# Altium project Sampling_Scope.PrjPcb (part 4 of 4)

## Sheet USB_C_PD.SchDoc
size A4; ApprovedBy: Mateusz Kowalik; CheckedBy: Mateusz Kowalik; Author: Mateusz Kowalik; CompanyName: InMotion Labs sp. z o.o.; DrawnBy: Mateusz Kowalik; Engineer: Mateusz Kowalik; Organization: InMotion Labs sp. z o.o.; Address1: Rydlówka 5A; Address2: 30-363 Kraków; Address4: Poland; DocumentNumber: 17; Revision: Rev 0; SheetNumber: 17; SheetTotal: 17
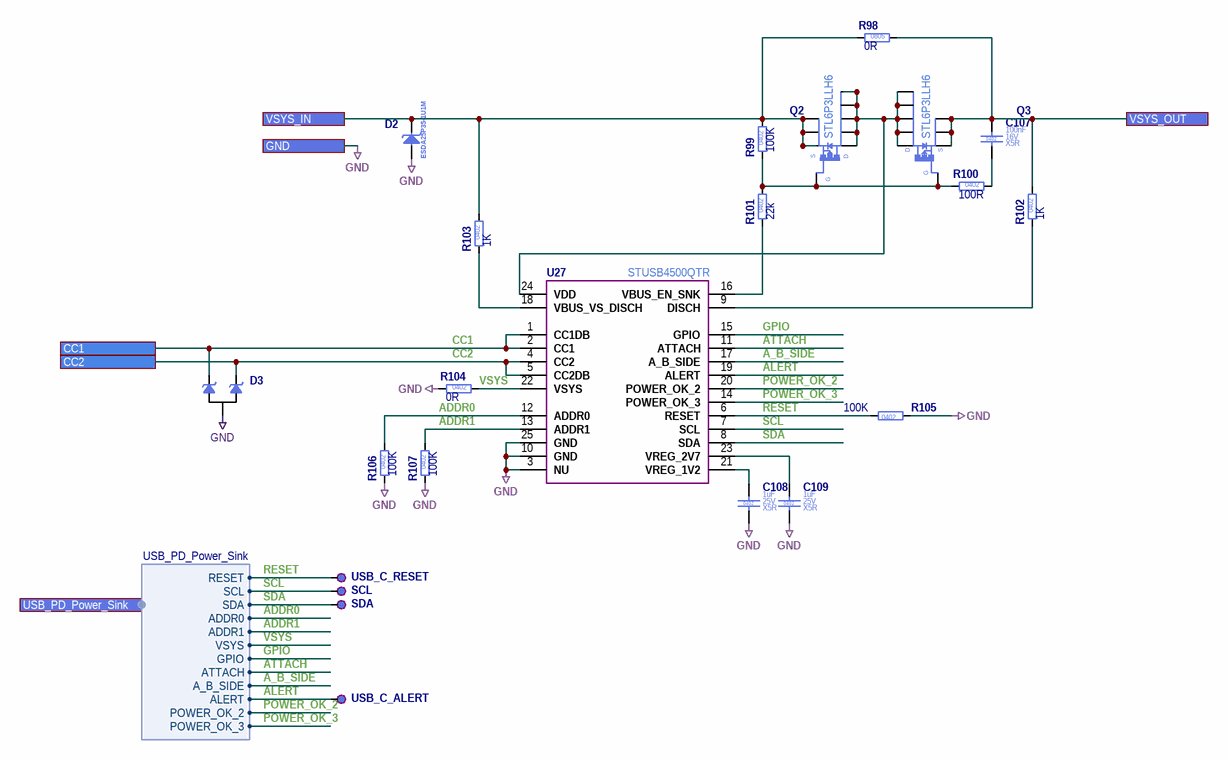
[diagram p17: USB_C_PD.SchDoc]

### Parts
C107  Case/Package: 0402  Voltage Rating (DC): 16V  Dielectric: X5R  Capacitance: 100nF  [C_0402_1005]  (hidden comment: C_100NF_16V_X5R_0402_10)
C108  Case/Package: 0402  Voltage Rating (DC): 25V  Dielectric: X5R  Capacitance: 1uF  [C_0402_1005]  (hidden comment: C_1UF_25V_X5R_0402_10)
C109  Case/Package: 0402  Voltage Rating (DC): 25V  Dielectric: X5R  Capacitance: 1uF  [C_0402_1005]  (hidden comment: C_1UF_25V_X5R_0402_10)
D2  ESDA25P35-1U1M  [TVS_0603_1610]
D3  ESDA25W  [SOT323_SC70]  (value not drawn)
Q2  STL6P3LLH6  [PQFN65P330X332X105_HS-9N]
Q3  STL6P3LLH6  [PQFN65P330X332X105_HS-9N]
R98  Resistance: 0R  Case/Package: 0805  [R_0805_2012]  (hidden comment: R_0R_0805_1)
R99  Resistance: 100K  Case/Package: 0402  [R_0402_1005]  (hidden comment: R_100K_0402_1)
R100  Resistance: 100R  Case/Package: 0402  [R_0402_1005]  (hidden comment: R_100R_0402_1)
R101  Resistance: 22k  Case/Package: 0402  [R_0402_1005]  (hidden comment: R_22K_0402_1)
R102  Resistance: 1K  Case/Package: 0402  [R_0402_1005]  (hidden comment: R_1K_0402_1)
R103  Resistance: 1K  Case/Package: 0402  [R_0402_1005]  (hidden comment: R_1K_0402_1)
R104  Resistance: 0R  Case/Package: 0402  [R_0402_1005]  (hidden comment: R_0R_0402_1)
R105  Resistance: 100K  Case/Package: 0402  [R_0402_1005]  (hidden comment: R_100K_0402_1)
R106  Resistance: 100K  Case/Package: 0402  [R_0402_1005]  (hidden comment: R_100K_0402_1)
R107  Resistance: 100K  Case/Package: 0402  [R_0402_1005]  (hidden comment: R_100K_0402_1)
SCL  TP_PAD_1.3MM  [TP_PAD_1.3MM]  (value not drawn)  (no BOM)
SDA  TP_PAD_1.3MM  [TP_PAD_1.3MM]  (value not drawn)  (no BOM)
U27  STUSB4500QTR  [QFN50P400X400X100_HS-25N]
USB_C_ALERT  TP_PAD_1.3MM  [TP_PAD_1.3MM]  (value not drawn)  (no BOM)
USB_C_RESET  TP_PAD_1.3MM  [TP_PAD_1.3MM]  (value not drawn)  (no BOM)

### Ports
CC1, CC2, GND, USB_PD_Power_Sink (harness USB_PD_Power_Sink), VSYS_IN, VSYS_OUT

### Harnesses
USB_PD_Power_Sink: RESET, SCL, SDA, ADDR0, ADDR1, VSYS, GPIO, ATTACH, A_B_SIDE, ALERT, POWER_OK_2, POWER_OK_3

### Nets
5V0_USB: C107.1 Q3.1(S) Q3.2(S) Q3.3(S) R98.2 R102.2 ; port VSYS_OUT
5V0_VBUS: D2.1(C) Q2.1(S) Q2.2(S) Q2.3(S) R98.1 R99.2 R103.2 ; port VSYS_IN
GND: C108.2 C109.2 D2.2(A) D3.3 R104.1 R105.1 R106.1 R107.1 U27.3(NU) U27.10(GND) U27.25(GND) ; port GND
A_B_SIDE: U27.17(A_B_SIDE) ; port USB_PD_Power_Sink.A_B_SIDE  [project net USB_PD_Power_Sink.A_B_SIDE]
ADDR0: R106.2 U27.12(ADDR0) ; port USB_PD_Power_Sink.ADDR0  [project net USB_PD_Power_Sink.ADDR0]
ADDR1: R107.2 U27.13(ADDR1) ; port USB_PD_Power_Sink.ADDR1  [project net USB_PD_Power_Sink.ADDR1]
ALERT: U27.19(ALERT) USB_C_ALERT.1(TP) ; port USB_PD_Power_Sink.ALERT  [project net USB_PD_Power_Sink.ALERT]
ATTACH: U27.11(ATTACH) ; port USB_PD_Power_Sink.ATTACH  [project net USB_PD_Power_Sink.ATTACH]
CC1: D3.1 U27.1(CC1DB) U27.2(CC1) ; port CC1
CC2: D3.2 U27.4(CC2) U27.5(CC2DB) ; port CC2
GPIO: U27.15(GPIO) ; port USB_PD_Power_Sink.GPIO  [project net USB_PD_Power_Sink.GPIO]
POWER_OK_2: U27.20(POWER_OK_2) ; port USB_PD_Power_Sink.POWER_OK_2  [project net USB_PD_Power_Sink.POWER_OK_2]
POWER_OK_3: U27.14(POWER_OK_3) ; port USB_PD_Power_Sink.POWER_OK_3  [project net USB_PD_Power_Sink.POWER_OK_3]
RESET: R105.2 U27.6(RESET) USB_C_RESET.1(TP) ; port USB_PD_Power_Sink.RESET  [project net USB_PD_Power_Sink.RESET]
SCL: SCL.1(TP) U27.7(SCL) ; port USB_PD_Power_Sink.SCL  [project net USB_PD_Power_Sink.SCL]
SDA: SDA.1(TP) U27.8(SDA) ; port USB_PD_Power_Sink.SDA  [project net USB_PD_Power_Sink.SDA]
VSYS: R104.2 U27.22(VSYS) ; port USB_PD_Power_Sink.VSYS  [project net USB_PD_Power_Sink.VSYS]
NetC107_2: C107.2 R100.2
NetC108_1: C108.1 U27.21(VREG_1V2)
NetC109_1: C109.1 U27.23(VREG_2V7)
NetQ2_4: Q2.4(G) Q3.4(G) R99.1 R100.1 R101.2
NetQ2_5: Q2.5(D) Q2.6(D) Q2.7(D) Q2.8(D) Q2.9(D) Q3.5(D) Q3.6(D) Q3.7(D) Q3.8(D) Q3.9(D) U27.24(VDD)
NetR101_1: R101.1 U27.16(VBUS_EN_SNK)
NetR102_1: R102.1 U27.9(DISCH)
NetR103_1: R103.1 U27.18(VBUS_VS_DISCH)

### Notes on the sheet
- Title
- Size:
- Date:
- A4

### Library data of the parts
C107 = C_100NF_16V_X5R_0402_10: Ceramic Capacitor; Manufacturer Part Number: EMK105BJ104KV-F; Manufacturer: Taiyo Yuden; Value: 100nF; Tolerance: 10%; Part Number: C_100NF_16V_X5R_0402_10; Mount: Surface Mount; Height: 500um; HelpURL: http://datasheet.octopart.com/EMK105BJ104KV-F-Taiyo-Yuden-datasheet-8857305.pdf; RoHS: Compliant; Max Operating Temperature: 125°C; Status: MK; Supplier 1: Mouser; Supplier Part Number 1: 963-EMK105BJ104KV-F; Manufacturer 2: Samsung Electro-Mechanics; Manufacturer Part Number 2: CL05B104KO5NNNC; Supplier 2: LCSC; Supplier Part Number 2: C1525
C108 C109 = C_1UF_25V_X5R_0402_10: Ceramic Capacitor; Manufacturer Part Number: CL05A105KA5NQNC; Manufacturer: Samsung Electro-Mechanics; Value: 1uF; Tolerance: 10%; Part Number: C_1UF_25V_X5R_0402_10; Mount: Surface Mount; Height: 550um; HelpURL: https://pl.mouser.com/datasheet/2/585/MLCC-1837944.pdf; RoHS: Compliant; Max Operating Temperature: 85°C; Status: MK; Supplier 1: Mouser; Supplier Part Number 1: 187-CL05A105KA5NQNC; Manufacturer 2: Samsung Electro-Mechanics; Manufacturer Part Number 2: CL05A105KA5NQNC; Supplier 2: LCSC; Supplier Part Number 2: C52923
D2 = ESDA25P35-1U1M: High power transient voltage suppressor; Manufacturer: STMicroelectronics; Max Power Dissipation: 1400W; Direction: Unidirectional; Max Breakdown Voltage: 24.6; Working Voltage: 22V; Min Breakdown Voltage: 23.3V; Box: 391; Part Number: ESDA25P35-1U1M; Case/Package: 0603; Manufacturer Part Number: ESDA25P35-1U1M; Mount: Surface Mount; HelpURL: https://pl.mouser.com/datasheet/2/389/esda25p35_1u1m-1848969.pdf; Max Operating Temperature: 150°C; RoHS: Compliant; Status: MK; Supplier 1: Mouser; Supplier Part Number 1: 511-ESDA25P35-1U1M; Height: 600um; Stock: 20
D3 = ESDA25W: TVS DIODE 24VWM SOT23; Manufacturer: STMicroelectronics; Capacitance: 65pF; Max Power Dissipation: 400W; Direction: Unidirectional; Max Breakdown Voltage: 30V; Working Voltage: 24V; Min Breakdown Voltage: 25V; Box: 395; Part Number: ESDA25W; Case/Package: SOT-23; Manufacturer Part Number: ESDA25W; Mount: Surface Mount; HelpURL: https://pl.mouser.com/datasheet/2/389/esdaxxxwx-1849182.pdf; Max Operating Temperature: 125°C; Height: 1.4mm; Status: MK; Supplier 1: Mouser; Supplier Part Number 1: 511-ESDA25W; Stock: 5
Q2 Q3 = STL6P3LLH6: P-MOSFET 30V 6A 24mOhm; Manufacturer: STMicroelectronics; Max Power Dissipation: 2.9W; Drain to Source Resistance: 24mR; Polarization: PMOS; Threshold Voltage: 1V; Box: 399; Part Number: STL6P3LLH6; Manufacturer Part Number: STL6P3LLH6; Case/Package: PQFN; Continuous Drain Current: 6A; Drain to Source Voltage: 30V; Mount: Surface Mount; HelpURL: https://pl.mouser.com/datasheet/2/389/stl6p3llh6-1851075.pdf; Max Operating Temperature: 150°C; Status: MK; RoHS: Compliant; Supplier 1: Mouser; Supplier Part Number 1: 511-STL6P3LLH6; Stock: 15
R98 = R_0R_0805_1: Thick Film Resistor; Manufacturer: Yageo; Manufacturer Part Number: RC0805JR-070RL; Value: 0R; Tolerance: 5%; Voltage Rating (DC): 150V; Power Rating: 125mW; Stats: MK; Part Number: R_0R_0805_1; Mount: Surface Mount; Height: 500um; HelpURL: https://pl.mouser.com/datasheet/2/447/PYu-RC_Group_51_RoHS_L_10-1527934.pdf; RoHS: Compliant; Max Operating Temperature: 155°C; Supplier 1: Mouser; Supplier Part Number 1: 603-RC0805JR-070RL; Manufacturer 2: Uniroyal Elec; Manufacturer Part Number 2: 0805W8F0000T5E; Supplier 2: LCSC; Supplier Part Number 2: C17477
R99 R105-R107 = R_100K_0402_1: Thick Film Resistor; Manufacturer: Yageo; Manufacturer Part Number: RC0402FR-07100KL; Value: 100K; Tolerance: 1%; Voltage Rating (DC): 50V; Power Rating: 63mW; Stats: MK; Part Number: R_100K_0402_1; Mount: Surface Mount; Height: 350um; HelpURL: http://datasheet.octopart.com/RC0402FR-07100KL-Yageo-datasheet-127823281.pdf; RoHS: Compliant; Max Operating Temperature: 155°C; Supplier 1: Mouser; Supplier Part Number 1: 603-RC0402FR-07100KL; Manufacturer 2: Uniroyal Elec; Manufacturer Part Number 2: 0402WGF1003TCE; Supplier 2: LCSC; Supplier Part Number 2: C25741
R100 = R_100R_0402_1: Thick Film Resistor; Manufacturer: Yageo; Manufacturer Part Number: RC0402FR-13100RL; Value: 100R; Tolerance: 1%; Voltage Rating (DC): 50V; Power Rating: 63mW; Part Number: R_100R_0402_1; Mount: Surface Mount; Height: 350um; HelpURL: https://pl.mouser.com/datasheet/2/447/PYu-RC_Group_51_RoHS_L_10-1527934.pdf; Max Operating Temperature: 155°C; Supplier 1: Mouser; Supplier Part Number 1: 603-RC0402FR-13100RL; Manufacturer 2: Uniroyal Elec; Manufacturer Part Number 2: 0402WGF1000TCE; RoHS: Compliant; Supplier 2: LCSC; Supplier Part Number 2: C25076
R101 = R_22K_0402_1: Thick Film resistor; Manufacturer: Yageo; Manufacturer Part Number: RC0402FR-0722KL; Value: 22k; Tolerance: 1%; Voltage Rating (DC): 50V; Power Rating: 63mW; Stats: MK; Part Number: R_22K_0402_1; Mount: Surface Mount; Height: 350um; HelpURL: http://datasheet.octopart.com/RC0402FR-0722KL-Yageo-datasheet-137700087.pdf; RoHS: Compliant; Max Operating Temperature: 155°C; Supplier 1: Mouser; Supplier Part Number 1: 603-RC0402FR-0722KL; Manufacturer 2: Uniroyal Elec; Manufacturer Part Number 2: 0402WGF2202TCE; Supplier 2: LCSC; Supplier Part Number 2: C25768
R102 R103 = R_1K_0402_1: Thick Film Resistor; Manufacturer: Yageo; Manufacturer Part Number: RC0402FR-7D1KL; Value: 1K; Tolerance: 1%; Voltage Rating (DC): 50V; Power Rating: 63mW; Stats: MK; Part Number: R_1K_0402_1; Mount: Surface Mount; Height: 350um; HelpURL: https://pl.mouser.com/datasheet/2/447/PYu-RC_Group_51_RoHS_L_10-1664068.pdf; RoHS: Compliant; Max Operating Temperature: 155°C; Supplier 1: Mouser; Supplier Part Number 1: 603-RC0402FR-7D1KL; Manufacturer 2: Uniroyal Elec; Manufacturer Part Number 2: 0402WGF1001TCE; Supplier 2: LCSC; Supplier Part Number 2: C11702
R104 = R_0R_0402_1: Thick Film Resistor; Manufacturer: Yageo; Manufacturer Part Number: RC0402FR-070RL; Value: 0R; Tolerance: 1%; Voltage Rating (DC): 50V; Power Rating: 63mW; Stats: MK; Part Number: R_0R_0402_1; Mount: Surface Mount; Height: 350um; HelpURL: http://datasheet.octopart.com/2176049-1-TE-Connectivity---AMP-datasheet-11120217.pdf; RoHS: Compliant; Max Operating Temperature: 155°C; Supplier 1: Mouser; Supplier Part Number 1: 603-RC0402FR-070RL; Manufacturer 2: Uniroyal Elec; Manufacturer Part Number 2: 0402WGF0000TCE; Supplier 2: LCSC; Supplier Part Number 2: C17168
SCL SDA USB_C_ALERT USB_C_RESET = TP_PAD_1.3MM: Testpoint SMD 1.3mm; Part Number: TP_PAD_1.3MM; Case/Package: SMD; Length: 0mm
U27 = STUSB4500QTR: Standalone USB PD controller for power sinking devices; Manufacturer: STMicroelectronics; Box: 92; Manufacturer Part Number: STUSB4500QTR; Part Number: STUSB4500QTR; Case/Package: QFN; Mount: Surface Mount; Height: 900um; HelpURL: https://www.st.com/resource/en/datasheet/stusb4500.pdf; Lead Free: Lead Free; Max Operating Temperature: 105°C; Min Operating Temperature: -40°C; Number of Pins: 24; RoHS: Compliant; Status: MK; Supplier 1: Mouser; Supplier Part Number 1: 511-STUSB4500QTR; Stock: 5

## Nets that join several sheets
3V3: POWER (L1.1), Power/LDO_ECL (5 pins)
3V3: POWER (L2.1), Power/LDO_CMOS (5 pins)
3V3_CMOS: Main (C4.1 U3.5), COMP_P (6 pins), MCU (30 pins), POWER (3V3_CMOS.1 C44.1 L2.2), Counter (11 pins), Thermal_MGMT (R86.2 R87.2 R88.2 R89.2), COMP_N (6 pins)
3V3_ECL: Main (7 pins), VREF_P/VREF_DAC (8 pins), COMP_P (12 pins), POWER (3V3_ECL.1 C43.1 L1.2), PROGRAMMABLE_DELAY_LINE_MAIN (8 pins), PROGRAMMABLE_DELAY_LINE_MAIN/DELAY_DAC (8 pins), ECL_Fanout_X3 (10 pins), Step_Gen (8 pins), CMOS_MUX (10 pins), VREF_N/VREF_DAC (8 pins), COMP_N (12 pins), ECL_Fanout_X2 (5 pins), PROGRAMMABLE_DELAY_LINE_STEP_GEN (8 pins), PROGRAMMABLE_DELAY_LINE_STEP_GEN/DELAY_DAC (8 pins)
3V8: POWER (3V8.1), Power/LDO_ECL (6 pins), Power/LDO_CMOS (6 pins), 3V8_SWITCHER (6 pins)
5N0: VREF_P (C79_VREF_P.2 C80_VREF_P.2 U17_VREF_P.4), COMP_P (C11_COMP_P.2 C12_COMP_P.2 R17_COMP_P.1 U4_COMP_P.13), POWER (5N0.1), SIMO_SWITCHER (C71.1 L6.2), Step_Gen (C73.2 C74.2 R39.1 U15.13), VREF_N (C79_VREF_N.2 C80_VREF_N.2 U17_VREF_N.4), COMP_N (C11_COMP_N.2 C12_COMP_N.2 R17_COMP_N.1 U4_COMP_N.13)
5P0: VREF_P (C79_VREF_P.1 C80_VREF_P.1 U17_VREF_P.7), COMP_P (C11_COMP_P.1 C12_COMP_P.1 U4_COMP_P.5 U4_COMP_P.16), POWER (5P0.1), SIMO_SWITCHER (C64.1 L5.2), Step_Gen (C73.1 C74.1 U15.5 U15.16), VREF_N (C79_VREF_N.1 C80_VREF_N.1 U17_VREF_N.7), COMP_N (C11_COMP_N.1 C12_COMP_N.1 U4_COMP_N.5 U4_COMP_N.16)
5V0_USB: POWER (5V0_USB.1 R24.2), 3V8_SWITCHER (C52.1 C53.1 R27.2 U14.3), SIMO_SWITCHER (6 pins), Thermal_MGMT (8 pins), USB_C_PD (6 pins)
5V0_VBUS: Main (J1.A4 J1.A9 J1.B4 J1.B9), USB_C_PD (7 pins)
GND: Main (56 pins), VREF_P (R47_VREF_P.1), VREF_P/VREF_DAC (12 pins), COMP_P (22 pins), MCU (41 pins), POWER (C43.2 C44.2), Power/LDO_ECL (10 pins), Power/LDO_CMOS (10 pins), 3V8_SWITCHER (9 pins), SIMO_SWITCHER (22 pins), PROGRAMMABLE_DELAY_LINE_MAIN (9 pins), PROGRAMMABLE_DELAY_LINE_MAIN/DELAY_DAC (12 pins), ECL_Fanout_X3 (10 pins), Step_Gen (9 pins), CMOS_MUX (8 pins), Counter (13 pins), Thermal_MGMT (24 pins), VREF_N (R47_VREF_N.1), VREF_N/VREF_DAC (12 pins), COMP_N (22 pins), ECL_Fanout_X2 (5 pins), PROGRAMMABLE_DELAY_LINE_STEP_GEN (9 pins), PROGRAMMABLE_DELAY_LINE_STEP_GEN/DELAY_DAC (12 pins), USB_C_PD (11 pins)
CC1: Main (CC1.1 J1.A5), USB_C_PD (D3.1 U27.1 U27.2)
CC2: Main (CC2.1 J1.B5), USB_C_PD (D3.2 U27.4 U27.5)
CLK_EN_0: MCU (U28.74), CMOS_MUX (R58.1 U20.1)
CLK_EN_1: MCU (U28.70), CMOS_MUX (R63.1 U21.1)
CLK_OUT: Main (CLK_OUT1.1), CMOS_MUX (R61.2 R62.2 R64.2)
CLK_SEL_0: MCU (U28.66), CMOS_MUX (U20.16)
CLK_SEL_1: MCU (U28.68), CMOS_MUX (U21.16)
CNTR_CTRL.CNTR_RESET: MCU (U28.88), Counter (CNTR_RST.1 U10.2 U22.1)
CNTR_Q0: MCU (U28.96), Counter (CNTR_Q0.1 R68.2)
CNTR_Q1: MCU (U28.93), Counter (CNTR_Q1.1 R70.2)
CNTR_Q2: MCU (U28.92), Counter (CNTR_Q2.1 R72.2)
CNTR_Q3: MCU (U28.91), Counter (CNTR_Q3.1 R74.2)
CNTR_Q4: MCU (U28.101), Counter (CNTR_Q4.1 R67.2)
CNTR_Q5: MCU (U28.113), Counter (CNTR_Q5.1 R69.2)
CNTR_Q6: MCU (U28.114), Counter (CNTR_Q6.1 R71.2)
CNTR_Q7: MCU (U28.115), Counter (CNTR_Q7.1 R73.2)
CNTR_Q8: MCU (U28.117), Counter (CNTR_Q8.1 R75.2)
CNTR_Q9: MCU (U28.118), Counter (CNTR_Q9.1 R76.2)
CNTR_Q10: MCU (U28.116), Counter (CNTR_Q10.1 R77.2)
CNTR_Q11: MCU (U28.99), Counter (CNTR_Q11.1 R78.2)
CNTR_Q12: MCU (U28.100), Counter (CNTR_Q12.1 R79.2)
CNTR_Q13: MCU (U28.98), Counter (CNTR_Q13.1 R80.2)
CNTR_Q14: MCU (U28.97), Counter (CNTR_Q14.1 R81.2)
CNTR_Q15: MCU (U28.102), Counter (CNTR_Q15.1 R82.2)
COMP_IN_N: Main (COMP_IN_N1.1), COMP_N (U4_COMP_N.2)
COMP_IN_P: Main (COMP_IN_P1.1), COMP_P (U4_COMP_P.2)
COMP_OUT_N: COMP_P (R11_COMP_P.2 U6_COMP_P.4), MCU (U28.89)
COMP_OUT_P: MCU (U28.34), COMP_N (R11_COMP_N.2 U6_COMP_N.4)
COMP_REG_CLK_N: CMOS_MUX (R65.2), COMP_N (COMP_REG_CLK_COMP_N.1 U7_COMP_N.2)
COMP_REG_CLK_P: COMP_P (COMP_REG_CLK_COMP_P.1 U7_COMP_P.2), CMOS_MUX (R60.2)
COUNTER: CMOS_MUX (R56.2), Counter (CNTR_CLK.1 U22.2)
DELAY_CLK: Main (DELAY_CLK.1 U1.7), CMOS_MUX (R59.2)
DELAY_OUT1_N: PROGRAMMABLE_DELAY_LINE_MAIN (U16_PROGRAMMABLE_DELAY_LINE_MAIN.20), ECL_Fanout_X3 (R49.1 R53.2 U18.7)
DELAY_OUT1_N: Step_Gen (R36.1 R38.2 U15.3 U15.4), PROGRAMMABLE_DELAY_LINE_STEP_GEN (U16_PROGRAMMABLE_DELAY_LINE_STEP_GEN.20)
DELAY_OUT1_P: PROGRAMMABLE_DELAY_LINE_MAIN (U16_PROGRAMMABLE_DELAY_LINE_MAIN.21), ECL_Fanout_X3 (R48.1 R52.2 U18.6)
DELAY_OUT1_P: Step_Gen (R35.1 R37.2 U15.1 U15.2), PROGRAMMABLE_DELAY_LINE_STEP_GEN (U16_PROGRAMMABLE_DELAY_LINE_STEP_GEN.21)
DELAY_Q0: MCU (U28.26), PROGRAMMABLE_DELAY_LINE_MAIN (U16_PROGRAMMABLE_DELAY_LINE_MAIN.23)
DELAY_Q0: MCU (U28.56), PROGRAMMABLE_DELAY_LINE_STEP_GEN (U16_PROGRAMMABLE_DELAY_LINE_STEP_GEN.23)
DELAY_Q1: MCU (U28.22), PROGRAMMABLE_DELAY_LINE_MAIN (U16_PROGRAMMABLE_DELAY_LINE_MAIN.25)
DELAY_Q1: MCU (U28.65), PROGRAMMABLE_DELAY_LINE_STEP_GEN (U16_PROGRAMMABLE_DELAY_LINE_STEP_GEN.25)
DELAY_Q2: MCU (U28.21), PROGRAMMABLE_DELAY_LINE_MAIN (U16_PROGRAMMABLE_DELAY_LINE_MAIN.26)
DELAY_Q2: MCU (U28.64), PROGRAMMABLE_DELAY_LINE_STEP_GEN (U16_PROGRAMMABLE_DELAY_LINE_STEP_GEN.26)
DELAY_Q3: MCU (U28.20), PROGRAMMABLE_DELAY_LINE_MAIN (U16_PROGRAMMABLE_DELAY_LINE_MAIN.27)
DELAY_Q3: MCU (U28.57), PROGRAMMABLE_DELAY_LINE_STEP_GEN (U16_PROGRAMMABLE_DELAY_LINE_STEP_GEN.27)
DELAY_Q4: MCU (U28.19), PROGRAMMABLE_DELAY_LINE_MAIN (U16_PROGRAMMABLE_DELAY_LINE_MAIN.29)
DELAY_Q4: MCU (U28.58), PROGRAMMABLE_DELAY_LINE_STEP_GEN (U16_PROGRAMMABLE_DELAY_LINE_STEP_GEN.29)
DELAY_Q5: MCU (U28.18), PROGRAMMABLE_DELAY_LINE_MAIN (U16_PROGRAMMABLE_DELAY_LINE_MAIN.30)
DELAY_Q5: MCU (U28.59), PROGRAMMABLE_DELAY_LINE_STEP_GEN (U16_PROGRAMMABLE_DELAY_LINE_STEP_GEN.30)
DELAY_Q6: MCU (U28.15), PROGRAMMABLE_DELAY_LINE_MAIN (U16_PROGRAMMABLE_DELAY_LINE_MAIN.31)
DELAY_Q6: MCU (U28.60), PROGRAMMABLE_DELAY_LINE_STEP_GEN (U16_PROGRAMMABLE_DELAY_LINE_STEP_GEN.31)
DELAY_Q7: MCU (U28.14), PROGRAMMABLE_DELAY_LINE_MAIN (U16_PROGRAMMABLE_DELAY_LINE_MAIN.32)
DELAY_Q7: MCU (U28.63), PROGRAMMABLE_DELAY_LINE_STEP_GEN (U16_PROGRAMMABLE_DELAY_LINE_STEP_GEN.32)
DELAY_Q8: MCU (U28.13), PROGRAMMABLE_DELAY_LINE_MAIN (U16_PROGRAMMABLE_DELAY_LINE_MAIN.1)
DELAY_Q8: MCU (U28.55), PROGRAMMABLE_DELAY_LINE_STEP_GEN (U16_PROGRAMMABLE_DELAY_LINE_STEP_GEN.1)
DELAY_Q9: MCU (U28.12), PROGRAMMABLE_DELAY_LINE_MAIN (U16_PROGRAMMABLE_DELAY_LINE_MAIN.2)
DELAY_Q9: MCU (U28.54), PROGRAMMABLE_DELAY_LINE_STEP_GEN (U16_PROGRAMMABLE_DELAY_LINE_STEP_GEN.2)
DELAY_Q10: MCU (U28.11), PROGRAMMABLE_DELAY_LINE_MAIN (U16_PROGRAMMABLE_DELAY_LINE_MAIN.3)
DELAY_Q10: MCU (U28.53), PROGRAMMABLE_DELAY_LINE_STEP_GEN (U16_PROGRAMMABLE_DELAY_LINE_STEP_GEN.3)
IN_N: Main (U1.3), ECL_Fanout_X2 (R95.1 R97.2 U26.6)
IN_N: PROGRAMMABLE_DELAY_LINE_MAIN (R41_PROGRAMMABLE_DELAY_LINE_MAIN.1 R43_PROGRAMMABLE_DELAY_LINE_MAIN.2 U16_PROGRAMMABLE_DELAY_LINE_MAIN.5), ECL_Fanout_X2 (U26.2)
IN_N: ECL_Fanout_X2 (U26.4), PROGRAMMABLE_DELAY_LINE_STEP_GEN (R41_PROGRAMMABLE_DELAY_LINE_STEP_GEN.1 R43_PROGRAMMABLE_DELAY_LINE_STEP_GEN.2 U16_PROGRAMMABLE_DELAY_LINE_STEP_GEN.5)
IN_P: Main (U1.2), ECL_Fanout_X2 (R94.1 R96.2 U26.7)
IN_P: PROGRAMMABLE_DELAY_LINE_MAIN (R40_PROGRAMMABLE_DELAY_LINE_MAIN.1 R42_PROGRAMMABLE_DELAY_LINE_MAIN.2 U16_PROGRAMMABLE_DELAY_LINE_MAIN.4), ECL_Fanout_X2 (U26.1)
IN_P: ECL_Fanout_X2 (U26.3), PROGRAMMABLE_DELAY_LINE_STEP_GEN (R40_PROGRAMMABLE_DELAY_LINE_STEP_GEN.1 R42_PROGRAMMABLE_DELAY_LINE_STEP_GEN.2 U16_PROGRAMMABLE_DELAY_LINE_STEP_GEN.4)
INT_CLK: Main (INT_CLK.1), MCU (U28.67), CMOS_MUX (U21.9)
LE_N: COMP_P (R6_COMP_P.1 R10_COMP_P.2 U4_COMP_P.6), ECL_Fanout_X3 (U19.2)
LE_N: ECL_Fanout_X3 (U19.4), COMP_N (R6_COMP_N.1 R10_COMP_N.2 U4_COMP_N.6)
LE_P: COMP_P (R5_COMP_P.1 R9_COMP_P.2 U4_COMP_P.7), ECL_Fanout_X3 (U19.1)
LE_P: ECL_Fanout_X3 (U19.3), COMP_N (R5_COMP_N.1 R9_COMP_N.2 U4_COMP_N.7)
NetC8_COMP_N_1: VREF_N (C81_VREF_N.2 R46_VREF_N.2 U17_VREF_N.6 VREF_VREF_N.1), COMP_N (C8_COMP_N.1 R14_COMP_N.1)
NetC8_COMP_P_1: VREF_P (C81_VREF_P.2 R46_VREF_P.2 U17_VREF_P.6 VREF_VREF_P.1), COMP_P (C8_COMP_P.1 R14_COMP_P.1)
NetC20_VREF_N_VREF_DAC_1: VREF_N (R45_VREF_N.2), VREF_N/VREF_DAC (5 pins)
NetC20_VREF_P_VREF_DAC_1: VREF_P (R45_VREF_P.2), VREF_P/VREF_DAC (5 pins)
NetDAC_OUT_VREF_N_1: VREF_N (DAC_OUT_VREF_N.1 U17_VREF_N.3), VREF_N/VREF_DAC (R19_VREF_N_VREF_DAC.2)
NetDAC_OUT_VREF_P_1: VREF_P (DAC_OUT_VREF_P.1 U17_VREF_P.3), VREF_P/VREF_DAC (R19_VREF_P_VREF_DAC.2)
NetR19_PROGRAMMABLE_DELAY_LINE_MAIN_DELAY_DAC_2: PROGRAMMABLE_DELAY_LINE_MAIN (U16_PROGRAMMABLE_DELAY_LINE_MAIN.17), PROGRAMMABLE_DELAY_LINE_MAIN/DELAY_DAC (R19_PROGRAMMABLE_DELAY_LINE_MAIN_DELAY_DAC.2)
NetR19_PROGRAMMABLE_DELAY_LINE_STEP_GEN_DELAY_DAC_2: PROGRAMMABLE_DELAY_LINE_STEP_GEN (U16_PROGRAMMABLE_DELAY_LINE_STEP_GEN.17), PROGRAMMABLE_DELAY_LINE_STEP_GEN/DELAY_DAC (R19_PROGRAMMABLE_DELAY_LINE_STEP_GEN_DELAY_DAC.2)
OSC_FB: Main (U2.1), CMOS_MUX (U20.9)
OUT1_N: Main (R1.1 R3.2 U2.3), ECL_Fanout_X3 (U18.2)
OUT1_P: Main (R2.1 R4.2 U2.2), ECL_Fanout_X3 (U18.1)
PD_MAIN_FB: MCU (U28.47), PROGRAMMABLE_DELAY_LINE_MAIN/DELAY_DAC (DELAY_Q11_PROGRAMMABLE_DELAY_LINE_MAIN_DELAY_DAC.1 R20_PROGRAMMABLE_DELAY_LINE_MAIN_DELAY_DAC.2)
PD_MAIN_LDAC: MCU (U28.36), PROGRAMMABLE_DELAY_LINE_MAIN/DELAY_DAC (DAC_LATCH_PROGRAMMABLE_DELAY_LINE_MAIN_DELAY_DAC.1 U9_PROGRAMMABLE_DELAY_LINE_MAIN_DELAY_DAC.5)
PD_STEP_FB: MCU (U28.50), PROGRAMMABLE_DELAY_LINE_STEP_GEN/DELAY_DAC (DELAY_Q11_PROGRAMMABLE_DELAY_LINE_STEP_GEN_DELAY_DAC.1 R20_PROGRAMMABLE_DELAY_LINE_STEP_GEN_DELAY_DAC.2)
PD_STEP_LDAC: MCU (U28.90), PROGRAMMABLE_DELAY_LINE_STEP_GEN/DELAY_DAC (DAC_LATCH_PROGRAMMABLE_DELAY_LINE_STEP_GEN_DELAY_DAC.1 U9_PROGRAMMABLE_DELAY_LINE_STEP_GEN_DELAY_DAC.5)
POWER_CTRL.ECL_EN: MCU (U28.9), POWER (ECL_EN.1), Power/LDO_ECL (R109_LDO_ECL.1 U12_LDO_ECL.4 U13_LDO_ECL.4)
POWER_CTRL.SIMO_EN: MCU (U28.2), POWER (R24.1 SIMO_EN.1), SIMO_SWITCHER (Q1.7)
PROG_DELAY_MAIN_CS: MCU (U28.110), PROGRAMMABLE_DELAY_LINE_MAIN/DELAY_DAC (DAC_nCS_PROGRAMMABLE_DELAY_LINE_MAIN_DELAY_DAC.1 U9_PROGRAMMABLE_DELAY_LINE_MAIN_DELAY_DAC.2)
PROG_DELAY_STEP_GEN_CS: MCU (U28.3), PROGRAMMABLE_DELAY_LINE_STEP_GEN/DELAY_DAC (DAC_nCS_PROGRAMMABLE_DELAY_LINE_STEP_GEN_DELAY_DAC.1 U9_PROGRAMMABLE_DELAY_LINE_STEP_GEN_DELAY_DAC.2)
RT0: MCU (U28.46), Thermal_MGMT (C98.1 R90.2 S_RT0.1)
RT1: MCU (U28.45), Thermal_MGMT (C100.1 R91.2 S_RT1.1)
RT2: MCU (U28.44), Thermal_MGMT (C102.1 R92.2 S_RT2.1)
RT3: MCU (U28.43), Thermal_MGMT (C104.1 R93.2 S_RT3.1)
SAMPLE_CLK: Main (SAMPLE_CLK.1), MCU (U28.87), CMOS_MUX (R57.2)
SPI3_MOSI: MCU (U28.48), PROGRAMMABLE_DELAY_LINE_MAIN/DELAY_DAC (DAC_MOSI_PROGRAMMABLE_DELAY_LINE_MAIN_DELAY_DAC.1 U9_PROGRAMMABLE_DELAY_LINE_MAIN_DELAY_DAC.4)
SPI3_SCK: MCU (U28.111), PROGRAMMABLE_DELAY_LINE_MAIN/DELAY_DAC (DAC_SCL_PROGRAMMABLE_DELAY_LINE_MAIN_DELAY_DAC.1 U9_PROGRAMMABLE_DELAY_LINE_MAIN_DELAY_DAC.3)
SPI4_MOSI: MCU (U28.5), PROGRAMMABLE_DELAY_LINE_STEP_GEN/DELAY_DAC (DAC_MOSI_PROGRAMMABLE_DELAY_LINE_STEP_GEN_DELAY_DAC.1 U9_PROGRAMMABLE_DELAY_LINE_STEP_GEN_DELAY_DAC.4)
SPI4_SCK: MCU (U28.1), PROGRAMMABLE_DELAY_LINE_STEP_GEN/DELAY_DAC (DAC_SCL_PROGRAMMABLE_DELAY_LINE_STEP_GEN_DELAY_DAC.1 U9_PROGRAMMABLE_DELAY_LINE_STEP_GEN_DELAY_DAC.3)
STEP_GEN_FEED_N: Main (PS2.1), Step_Gen (U15.10)
STEP_GEN_FEED_P: Main (PS1.1), Step_Gen (U15.11)
THERMAL_MGMT.IN1H: MCU (U28.125), Thermal_MGMT (U25.5)
THERMAL_MGMT.IN1L: MCU (U28.126), Thermal_MGMT (U25.6)
THERMAL_MGMT.IN2H: MCU (U28.127), Thermal_MGMT (U25.7)
THERMAL_MGMT.IN2L: MCU (U28.128), Thermal_MGMT (U25.8)
THERMAL_MGMT.nSLEEP: MCU (U28.129), Thermal_MGMT (U25.9)
TRIGGER_IN: Main (TRIGGER_IN.1 U3.4), CMOS_MUX (U21.8)
USB_D_N: Main (L8.1), MCU (U28.103)
USB_D_P: Main (L8.4), MCU (U28.104)
USB_PD_Power_Sink.ALERT: MCU (U28.8), USB_C_PD (U27.19 USB_C_ALERT.1)
USB_PD_Power_Sink.RESET: MCU (U28.29), USB_C_PD (R105.2 U27.6 USB_C_RESET.1)
USB_PD_Power_Sink.SCL: MCU (R110.1 U28.136), USB_C_PD (SCL.1 U27.7)
USB_PD_Power_Sink.SDA: MCU (R111.1 U28.137), USB_C_PD (SDA.1 U27.8)
VREF_N_CTRL~{.}CS: MCU (U28.73), VREF_N/VREF_DAC (DAC_nCS_VREF_N_VREF_DAC.1 U9_VREF_N_VREF_DAC.2)
VREF_N_CTRL~{.}LDAC: MCU (U28.7), VREF_N/VREF_DAC (DAC_LATCH_VREF_N_VREF_DAC.1 U9_VREF_N_VREF_DAC.5)
VREF_N_CTRL.DAC_FB: MCU (U28.42), VREF_N/VREF_DAC (DELAY_Q11_VREF_N_VREF_DAC.1 R20_VREF_N_VREF_DAC.2)
VREF_N_CTRL.SCK: MCU (U28.69), VREF_N/VREF_DAC (DAC_SCL_VREF_N_VREF_DAC.1 U9_VREF_N_VREF_DAC.3)
VREF_N_CTRL.SDI: MCU (U28.27), VREF_N/VREF_DAC (DAC_MOSI_VREF_N_VREF_DAC.1 U9_VREF_N_VREF_DAC.4)
VREF_P_CTRL~{.}CS: VREF_P/VREF_DAC (DAC_nCS_VREF_P_VREF_DAC.1 U9_VREF_P_VREF_DAC.2), MCU (U28.40)
VREF_P_CTRL~{.}LDAC: VREF_P/VREF_DAC (DAC_LATCH_VREF_P_VREF_DAC.1 U9_VREF_P_VREF_DAC.5), MCU (U28.75)
VREF_P_CTRL.DAC_FB: VREF_P/VREF_DAC (DELAY_Q11_VREF_P_VREF_DAC.1 R20_VREF_P_VREF_DAC.2), MCU (U28.49)
VREF_P_CTRL.SCK: VREF_P/VREF_DAC (DAC_SCL_VREF_P_VREF_DAC.1 U9_VREF_P_VREF_DAC.3), MCU (U28.41)
VREF_P_CTRL.SDI: VREF_P/VREF_DAC (DAC_MOSI_VREF_P_VREF_DAC.1 U9_VREF_P_VREF_DAC.4), MCU (U28.123)

## Assembly variants
JLCPCB: not fitted C41 C42 CLK_OUT1 COMP_IN_N1 COMP_IN_P1 D1 D2 D3 D4 D5 DUT_N1 DUT_P1 FB1 FB2 FB3 FD1 FD2 GND1 GND2 GND3 GND4 GND5 J1 J2 J3 L1 L2 L3 L4 L5 L6 L7 L8 M1 PS1 PS2 Q1 Q2 Q3 R14_COMP_N R14_COMP_P R29 R30 R33 R34 R47_VREF_N R47_VREF_P RT1 RT2 RT3 RT4 S1 SNS_N1 SNS_P1 STM1 TRIGGER1 U1 U2 U3 U4_COMP_N U4_COMP_P U5_COMP_N U5_COMP_P U6_COMP_N U6_COMP_P U7_COMP_N U7_COMP_P U8_DELAY_DAC1 U8_DELAY_DAC2 U8_VREF_DAC1 U8_VREF_DAC2 U9_DELAY_DAC1 U9_DELAY_DAC2 U9_VREF_DAC1 U9_VREF_DAC2 U10 U11 U12_LDO_CMOS U12_LDO_ECL U13_LDO_CMOS U13_LDO_ECL U14 U15 U16_PROGRAMMABLE_DELAY_LINE_MAIN U16_PROGRAMMABLE_DELAY_LINE_STEP_GEN U17_VREF_N U17_VREF_P U18 U19 U20 U21 U22 U23 U24 U25 U26 U27 U28 XT1
NO JLCPCB: not fitted 3V3_CMOS 3V3_ECL 3V8 5N0 5P0 5V0_USB C1 C2 C3 C4 C5_COMP_N C5_COMP_P C6_COMP_N C6_COMP_P C7_COMP_N C7_COMP_P C8_COMP_N C8_COMP_P C9_COMP_N C9_COMP_P C10_COMP_N C10_COMP_P C11_COMP_N C11_COMP_P C12_COMP_N C12_COMP_P C13_COMP_N C13_COMP_P C14_COMP_N C14_COMP_P C15_COMP_N C15_COMP_P C16_COMP_N C16_COMP_P C17_DELAY_DAC1 C17_DELAY_DAC2 C17_VREF_DAC1 C17_VREF_DAC2 C18_DELAY_DAC1 C18_DELAY_DAC2 C18_VREF_DAC1 C18_VREF_DAC2 C19_DELAY_DAC1 C19_DELAY_DAC2 C19_VREF_DAC1 C19_VREF_DAC2 C20_DELAY_DAC1 C20_DELAY_DAC2 C20_VREF_DAC1 C20_VREF_DAC2 C21_DELAY_DAC1 C21_DELAY_DAC2 C21_VREF_DAC1 C21_VREF_DAC2 C22_DELAY_DAC1 C22_DELAY_DAC2 C22_VREF_DAC1 C22_VREF_DAC2 C23_DELAY_DAC1 C23_DELAY_DAC2 C23_VREF_DAC1 C23_VREF_DAC2 C24 C25 C26 C27 C29 C30 C31 C32 C33 C34 C35 C36 C37 C39 C40 C43 C44 C45_LDO_CMOS C45_LDO_ECL C46_LDO_CMOS C46_LDO_ECL C47_LDO_CMOS C47_LDO_ECL C48_LDO_CMOS C48_LDO_ECL C49_LDO_CMOS C49_LDO_ECL C50_LDO_CMOS C50_LDO_ECL C51 C52 C53 C54 C55 C56 C57 C58 C59 C60 C61 C62 C63 C64 C65 C66 C67 C68 C69 C70 C71 C72 C73 C74 C75 C76 C77_PROGRAMMABLE_DELAY_LINE_MAIN C77_PROGRAMMABLE_DELAY_LINE_STEP_GEN C78_PROGRAMMABLE_DELAY_LINE_MAIN C78_PROGRAMMABLE_DELAY_LINE_STEP_GEN C79_VREF_N C79_VREF_P C80_VREF_N C80_VREF_P C81_VREF_N C81_VREF_P C82 C83 C84 C85 C86 C87 C88 C89 C90 C91 C92 C93 C94 C95 C96 C97 C98 C99 C100 C101 C102 C103 C104 C105 C106 C107 C108 C109 C110 C111 C112 C113 C114 C115 C116 C120 C130 CC1 CC2 CNTR_CLK CNTR_nRST CNTR_Q0 CNTR_Q1 CNTR_Q2 CNTR_Q3 CNTR_Q4 CNTR_Q5 CNTR_Q6 CNTR_Q7 CNTR_Q8 CNTR_Q9 CNTR_Q10 CNTR_Q11 CNTR_Q12 CNTR_Q13 CNTR_Q14 CNTR_Q15 CNTR_RST COMP_REG_CLK_COMP_N COMP_REG_CLK_COMP_P DAC_LATCH_PROGRAMMABLE_DELAY_LINE_MAINA_DELAY_DACA DAC_LATCH_PROGRAMMABLE_DELAY_LINE_STEP_GENB_DELAY_DACB DAC_LATCH_VREF_NA_VREF_DACC DAC_LATCH_VREF_PB_VREF_DACD DAC_MOSI_PROGRAMMABLE_DELAY_LINE_MAINA_DELAY_DACA DAC_MOSI_PROGRAMMABLE_DELAY_LINE_STEP_GENB_DELAY_DACB DAC_MOSI_VREF_NA_VREF_DACC DAC_MOSI_VREF_PB_VREF_DACD DAC_nCS_PROGRAMMABLE_DELAY_LINE_MAINA_DELAY_DACA DAC_nCS_PROGRAMMABLE_DELAY_LINE_STEP_GENB_DELAY_DACB DAC_nCS_VREF_NA_VREF_DACC DAC_nCS_VREF_PB_VREF_DACD DAC_OUT_VREF_N DAC_OUT_VREF_P DAC_SCL_PROGRAMMABLE_DELAY_LINE_MAINA_DELAY_DACA DAC_SCL_PROGRAMMABLE_DELAY_LINE_STEP_GENB_DELAY_DACB DAC_SCL_VREF_NA_VREF_DACC DAC_SCL_VREF_PB_VREF_DACD DELAY_CLK DELAY_Q11_PROGRAMMABLE_DELAY_LINE_MAINA_DELAY_DACA DELAY_Q11_PROGRAMMABLE_DELAY_LINE_STEP_GENB_DELAY_DACB DELAY_Q11_VREF_NA_VREF_DACC DELAY_Q11_VREF_PB_VREF_DACD ECL_EN INT_CLK OUT2_PROGRAMMABLE_DELAY_LINE_MAINA_DELAY_DACA OUT2_PROGRAMMABLE_DELAY_LINE_STEP_GENB_DELAY_DACB OUT2_VREF_NA_VREF_DACC OUT2_VREF_PB_VREF_DACD OUT_PROGRAMMABLE_DELAY_LINE_MAINA_DELAY_DACA OUT_PROGRAMMABLE_DELAY_LINE_STEP_GENB_DELAY_DACB OUT_VREF_NA_VREF_DACC OUT_VREF_PB_VREF_DACD R1 R2 R3 R4 R5_COMP_N R5_COMP_P R6_COMP_N R6_COMP_P R7_COMP_N R7_COMP_P R8_COMP_N R8_COMP_P R9_COMP_N R9_COMP_P R10_COMP_N R10_COMP_P R11_COMP_N R11_COMP_P R12_COMP_N R12_COMP_P R13_COMP_N R13_COMP_P R15_COMP_N R15_COMP_P R16_COMP_N R16_COMP_P R17_COMP_N R17_COMP_P R18_DELAY_DAC1 R18_DELAY_DAC2 R18_VREF_DAC1 R18_VREF_DAC2 R19_DELAY_DAC1 R19_DELAY_DAC2 R19_VREF_DAC1 R19_VREF_DAC2 R20_DELAY_DAC1 R20_DELAY_DAC2 R20_VREF_DAC1 R20_VREF_DAC2 R21 R22 R23 R24 R25_LDO_CMOS R25_LDO_ECL R26_LDO_CMOS R26_LDO_ECL R27 R28 R31 R32 R35 R36 R37 R38 R39 R40_PROGRAMMABLE_DELAY_LINE_MAIN R40_PROGRAMMABLE_DELAY_LINE_STEP_GEN R41_PROGRAMMABLE_DELAY_LINE_MAIN R41_PROGRAMMABLE_DELAY_LINE_STEP_GEN R42_PROGRAMMABLE_DELAY_LINE_MAIN R42_PROGRAMMABLE_DELAY_LINE_STEP_GEN R43_PROGRAMMABLE_DELAY_LINE_MAIN R43_PROGRAMMABLE_DELAY_LINE_STEP_GEN R44_PROGRAMMABLE_DELAY_LINE_MAIN R44_PROGRAMMABLE_DELAY_LINE_STEP_GEN R45_VREF_N R45_VREF_P R46_VREF_N R46_VREF_P R48 R49 R50 R51 R52 R53 R54 R55 R56 R57 R58 R59 R60 R61 R62 R63 R64 R65 R66 R67 R68 R69 R70 R71 R72 R73 R74 R75 R76 R77 R78 R79 R80 R81 R82 R83 R84 R85 R86 R87 R88 R89 R90 R91 R92 R93 R94 R95 R96 R97 R98 R99 R100 R101 R102 R103 R104 R105 R106 R107 R108 R109_LDO_CMOS R109_LDO_ECL R110 R111 S_RT0 S_RT1 S_RT2 S_RT3 SAMPLE_CLK SCL SDA SIMO_EN TRIGGER_IN USB_C_ALERT USB_C_RESET VREF_PROGRAMMABLE_DELAY_LINE_MAINA_DELAY_DACA VREF_PROGRAMMABLE_DELAY_LINE_STEP_GENB_DELAY_DACB VREF_VREF_N VREF_VREF_NA_VREF_DACC VREF_VREF_P VREF_VREF_PB_VREF_DACD VTT VTT_COMP_N VTT_COMP_P